# Altium schematic sheet [06] - DOC REVISION HISTORY.SchDoc: DOC REVISION HISTORY
size A3; Author: Gabriel Piñango; DocumentNumber: 6; Revision: V1I1; SheetNumber: 6; SheetTotal: 6; Collaborator: Gabriel Pinango; Project: MultiTestcard; VersionRevision: V1I1; Designer: Gabriel Pinango; DocumentName: [06] - DOC REVISION HISTORY.SchDoc
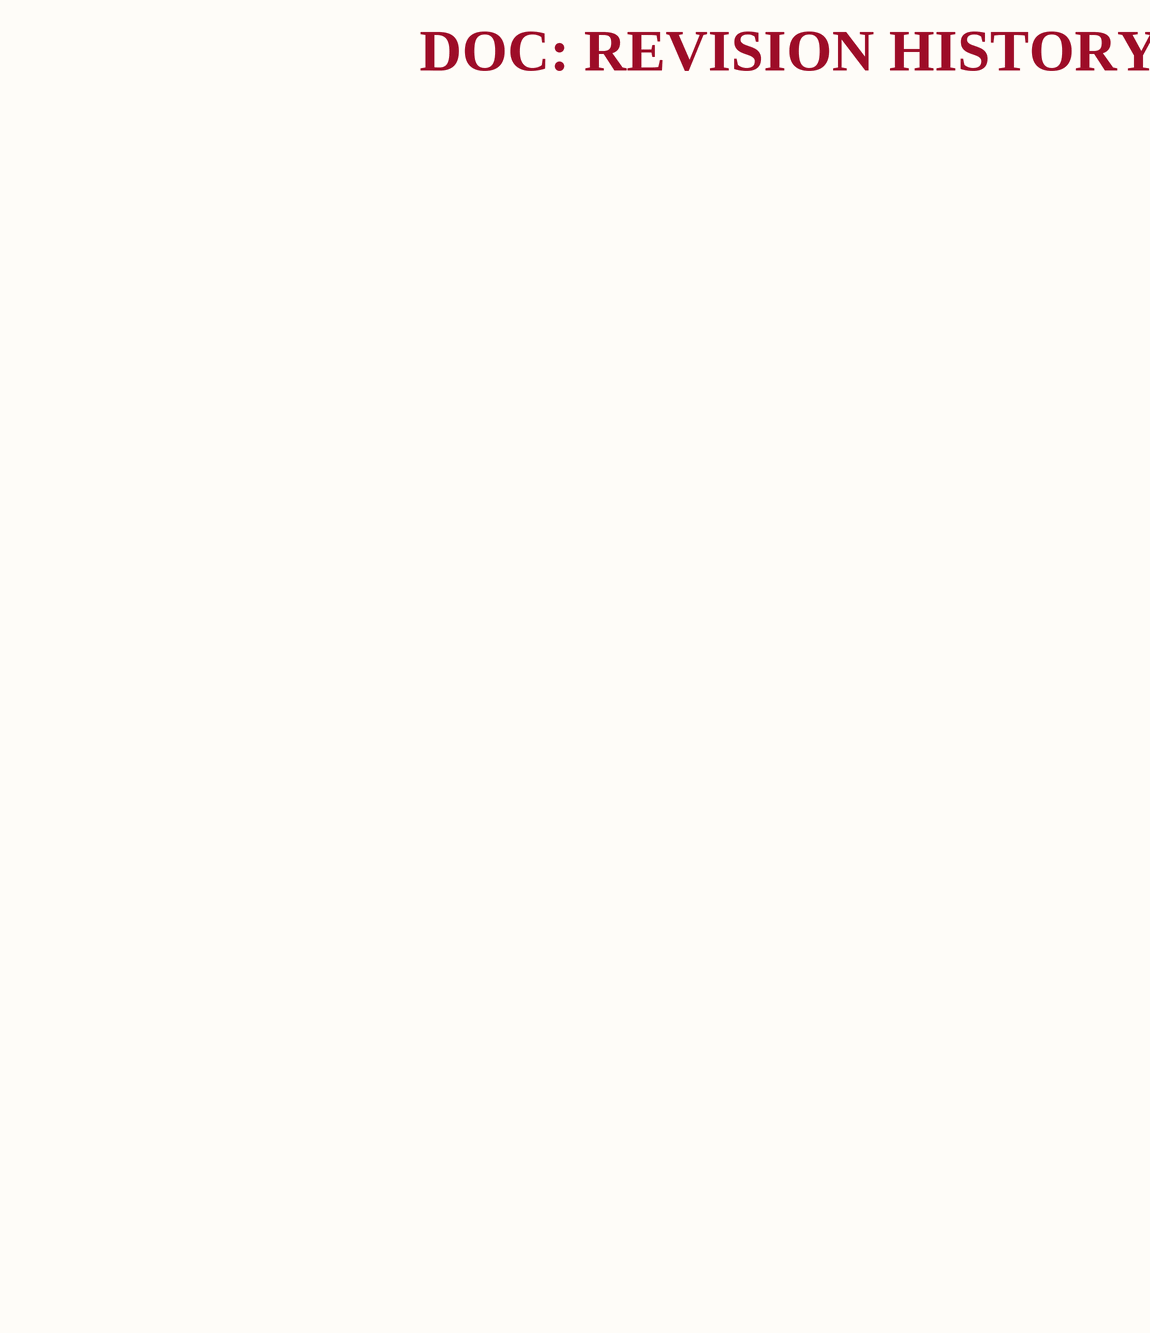
[diagram p0: [06] - DOC REVISION HISTORY.SchDoc]

## Notes on the sheet
- DOC: REVISION HISTORY
- CLOCKS (CPU & PCIE)
- Título
- Diseñado por
- Fecha:
- Proyecto
- Hora:
- Versión:
- Hoja
- de
- Archivo: